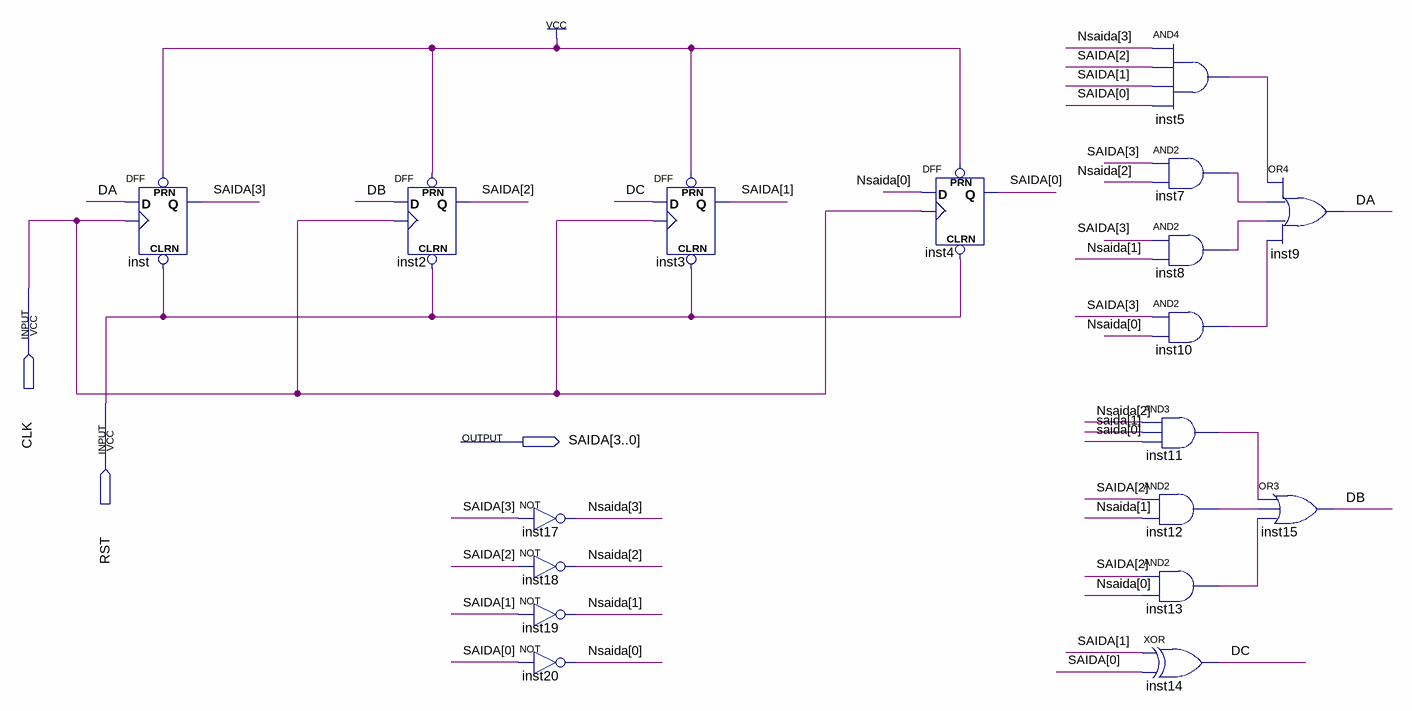
[diagram p0: schematic sheet]
// Quartus schematic ATV_3.bdf as structural Verilog: 18 symbols, 3 pins
module ATV_3 (
  input  CLK,
  input  RST,
  output [3:0] SAIDA
);

  wire DA, DB, DC, inst5_out, inst7_out, inst8_out, inst10_out, inst11_out, inst12_out, inst13_out;
  wire [3:0] Nsaida;

  DFF inst (.CLRN(RST), .CLK(CLK), .D(DA), .PRN(1'b1), .Q(SAIDA[3]));
  DFF inst2 (.CLRN(RST), .CLK(CLK), .D(DB), .PRN(1'b1), .Q(SAIDA[2]));
  not inst17 (Nsaida[3], SAIDA[3]);
  not inst18 (Nsaida[2], SAIDA[2]);
  not inst19 (Nsaida[1], SAIDA[1]);
  not inst20 (Nsaida[0], SAIDA[0]);
  DFF inst3 (.CLRN(RST), .CLK(CLK), .D(DC), .PRN(1'b1), .Q(SAIDA[1]));
  DFF inst4 (.CLRN(RST), .CLK(CLK), .D(Nsaida[0]), .PRN(1'b1), .Q(SAIDA[0]));
  and inst5 (inst5_out, Nsaida[3], SAIDA[2], SAIDA[1], SAIDA[0]);
  and inst7 (inst7_out, SAIDA[3], Nsaida[2]);
  and inst8 (inst8_out, SAIDA[3], Nsaida[1]);
  and inst10 (inst10_out, SAIDA[3], Nsaida[0]);
  and inst11 (inst11_out, Nsaida[2], SAIDA[1], SAIDA[0]);
  and inst12 (inst12_out, SAIDA[2], Nsaida[1]);
  and inst13 (inst13_out, SAIDA[2], Nsaida[0]);
  xor inst14 (DC, SAIDA[1], SAIDA[0]);
  or inst9 (DA, inst5_out, inst7_out, inst8_out, inst10_out);
  or inst15 (DB, inst11_out, inst12_out, inst13_out);
endmodule
